# Altium project LampOne.PrjPcb
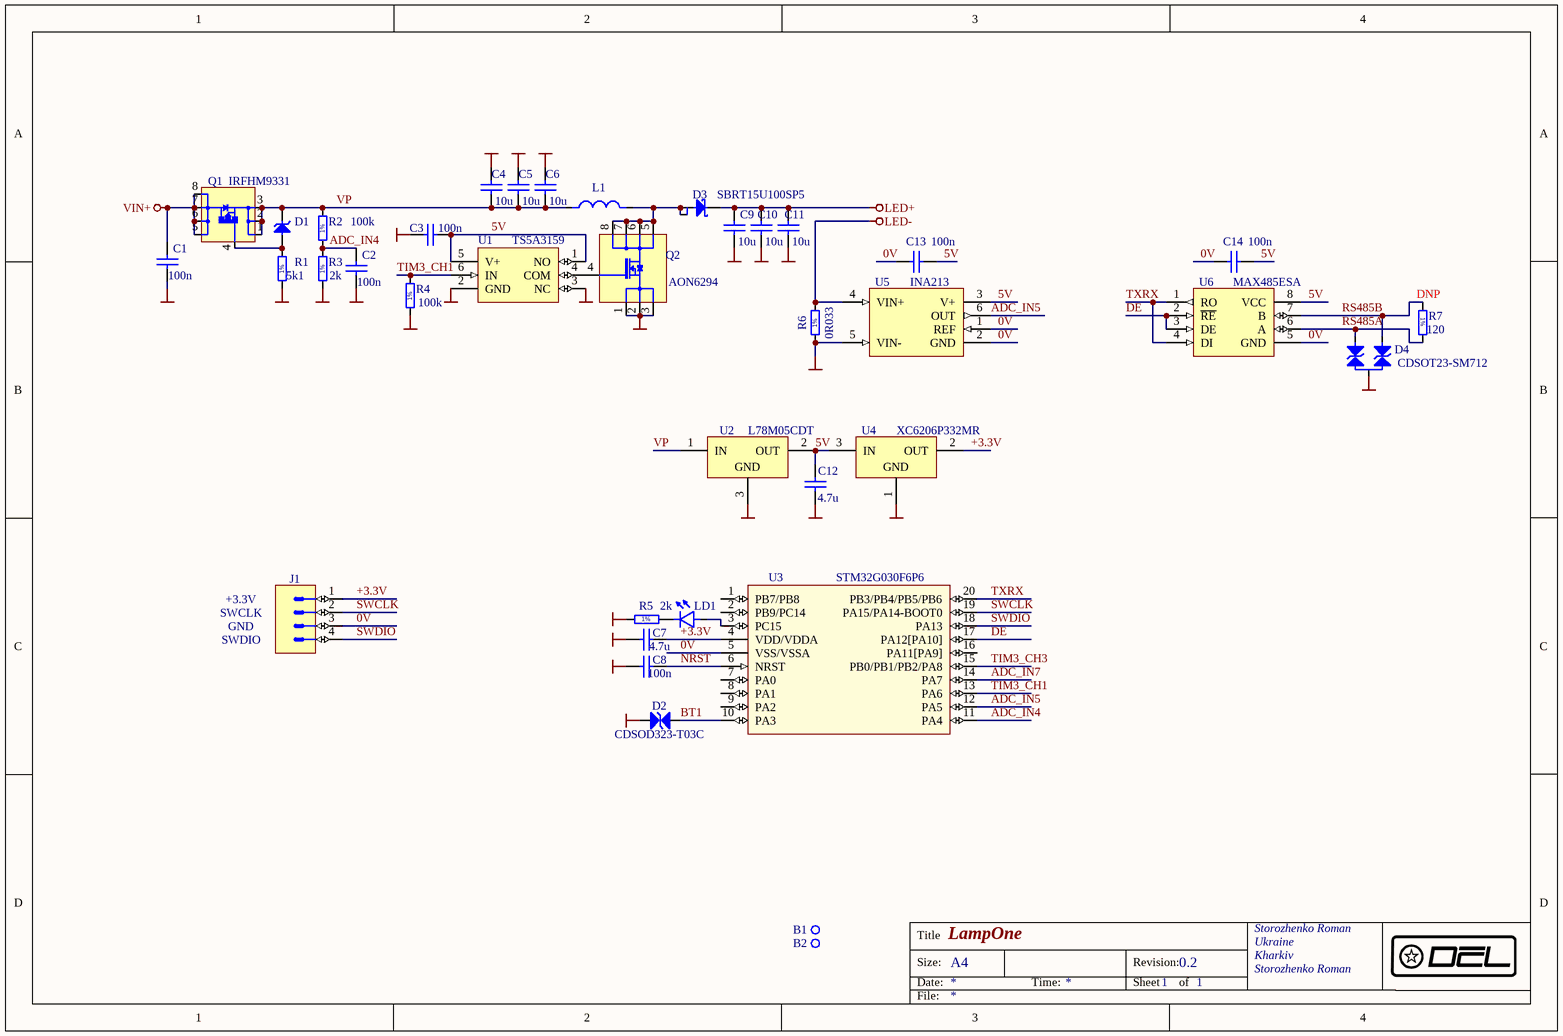
[diagram p0: LampOne.SchDoc]
1 sheet, 38 parts. Net scope: global (net labels, ports and power ports of the same name join across sheets).
Board file: LampOne.PcbDoc

## Sheet LampOne.SchDoc: LampOne
size A4; ApprovedBy: Storozhenko Roman; CheckedBy: Storozhenko Roman; Author: Storozhenko Roman; CompanyName: D_EL; Organization: Storozhenko Roman; Address1: Ukraine; Address2: Kharkiv; Revision: 0.2; SheetNumber: 1; SheetTotal: 1

### Parts
B1  Non Plated Hole  [MTG600H320V8P]  (value not drawn)
B2  Non Plated Hole  [MTG600H320V8P]  (value not drawn)
C1  100n  [CAPC1608X87N]
C2  100n  [CAPC1608X87N]
C3  100n  [CAPC1608X87N]
C4  10u  [CAPC3225X270N]
C5  10u  [CAPC3225X270N]
C6  10u  [CAPC3225X270N]
C7  4.7u  [CAPC1608X87N]
C8  100n  [CAPC1608X87N]
C9  10u  [CAPC3225X270N]
C10  10u  [CAPC3225X270N]
C11  10u  [CAPC3225X270N]
C12  4.7u  [CAPC1608X87N]
C13  100n  [CAPC1608X87N]
C14  100n  [CAPC1608X87N]
D1  BZV55-B10  [DIOMELF3515N]  (value not drawn)
D2  CDSOD323-T03C  [SOD2512X110N]
D3  SBRT15U100SP5  [SBRT15U100SP5]
D4  CDSOT23-SM712  [SOT95P240X130-3N]
J1  Header 4  [3M_2304-6111-TG]  (value not drawn)
L1  10uH  [IND_BOURNS_PM127SH]  (value not drawn)
LD1  Red  [LEDC1608X80N_RED]  (value not drawn)
Q1  IRFHM9331  [PQFN50P300X300X100_HS-9N]
Q2  AON6294  [DFN-5X6-8L]
R1  5k1  [RESC1608X55N]
R2  100k  [RESC1608X55N]
R3  2k  [RESC1608X55N]
R4  100k  [RESC1608X55N]
R5  2k  [RESC1608X55N]
R6  0R033  [RESC3216X80N]
R7  120  Mounted: DNP  [RESC1005X40N]
U1  TS5A3159  [SOT65P210X110-6N]
U2  L78M05CDT  [TO228P1010X239-3N-R521X544]
U3  STM32G030F6P6  [SOP65P640X110-20N]
U4  XC6206P332MR  [SOT95P280X115-3N]
U5  INA213  [SOT65P210X110-6N]
U6  MAX485ESA  [SOIC127P600X175-8N]

### Nets
0V: C1.1 C2.1 C3.2 C4.1 C5.1 C6.1 C7.1 C8.1 C9.1 C10.1 C11.1 C12.1 C13.2 C14.2 D2.2(A) D4.3 J1.3 Q2.1(S) Q2.2(S) Q2.3(S) R1.1 R3.1 R4.1 R5.1 R6.1 U1.2(GND) U1.3(NC) U2.3(GND) U3.5(VSS/VSSA) U4.1(GND) U5.1(REF) U5.2(GND) U5.5(VIN-) U6.5(GND)
LED+: C9.2 C10.2 C11.2 D3.3(C)
LED-: R6.2 U5.4(VIN+)
VIN+: C1.2 Q1.5(D) Q1.6(D) Q1.7(D) Q1.8(D)
5V: C3.1 C12.2 C13.1 C14.1 U1.1(NO) U1.5(V+) U2.2(OUT) U4.3(IN) U5.3(V+) U6.8(VCC)
+3.3V: C7.2 J1.1 U3.4(VDD/VDDA) U4.2(OUT)
ADC_IN4: C2.2 R2.1 R3.2 U3.11(PA4)
ADC_IN5: U3.12(PA5) U5.6(OUT)
ADC_IN7: U3.14(PA7)
BT1: D2.1(C) U3.10(PA3)
DE: U3.17(PA12[PA10]) U6.2(~{RE}) U6.3(DE)
NRST: C8.2 U3.6(NRST)
RS485A: D4.2 R7.2 U6.6(A)
RS485B: D4.1 R7.1 U6.7(B)
SWCLK: J1.2 U3.19(PA15/PA14-BOOT0)
SWDIO: J1.4 U3.18(PA13)
TIM3_CH1: R4.2 U1.6(IN) U3.13(PA6)
TIM3_CH3: U3.15(PB0/PB1/PB2/PA8)
TXRX: U3.20(PB3/PB4/PB5/PB6) U6.1(RO) U6.4(DI)
VP: C4.2 C5.2 C6.2 D1.1(C) L1.1 Q1.1(S) Q1.2(S) Q1.3(S) R2.2 U2.1(IN)
NetD1_2: D1.2(A) Q1.4(S) R1.2
NetD3_1: D3.1(A) D3.2(A) L1.2 Q2.5(D) Q2.6(D) Q2.7(D) Q2.8(D)
NetLD1_1: LD1.1(C) R5.2
NetLD1_2: LD1.2(A) U3.3(PC15)
NetQ2_4: Q2.4(G) U1.4(COM)

Not connected (* = marked no-connect by the designer): B1 1; B2 1; U3 1(PB7/PB8) 2(PB9/PC14) 7(PA0) 8(PA1) 9(PA2) 16(PA11[PA9])

### Notes on the sheet
- +3.3V
- SWCLK
- GND
- SWDIO
- Title
- Size:
- Date:
- A4
- Time:
- Revision:
- Sheet
- of
- File:
- (in symbol R0402_120R_1%_0.0625W_100PPM) 1%
- (in symbol R0603_2K_1%_0.1W_100PPM) 1%
- (in symbol R0603_5K1_1%_0.1W_100PPM) 1%
- (in symbol R0603_100K_1%_0.1W_100PPM) 1%
- (in symbol R1206_0R033_1%_0.25W_100PPM) 1%

### Library data of the parts
B1 B2 = NON-PLATED_HOLE3.2_PAD6.0_8p: Single Terminal Socket; Part Description: Through Hole: Hole Dia.=3.2mm Pad Dia.=6mm + 6 Via Dia.=0.3mm; Mounted: No; Part Number: NON-PLATED_HOLE3.2_PAD6.0_8p; Component Kind: Standard (No BOM); Component Type: Standard (No BOM); Pin Count: 1; Family: Non Plated Hole; Socket: No; SMD: No; Status: None; ComponentHeight: 0mm; Author: DEL; CreateDate: 11/21/2022; LatestRevisionDate: 11/21/2022; PackageDescription: Non Plated Through Hole: Hole Dia.=3.2mm
C1-C3 C8 C13 C14 = CC0603_100NF_50V_10%_X7R: Non-polarised capacitor; Part Description: SMD Multilayer Chip Ceramic Capacitor; Manufacturer: GENERIC; Voltage: 50V; TC: X7R; Tolerance: ±10%; Part Number: CC0603_100NF_50V_10%_X7R; Component Kind: Standard; Component Type: Standard; Pin Count: 2; Value: 100n; Status: Preferred; Manufacturer Part Number: CC0603_100NF_50V_10%_X7R; Case: 0603; Mounted: Yes; Socket: No; SMD: Yes; Manufacturer1 ComponentHeight: 0.87mm; Author: Elman; CreateDate: 7/14/2014; LatestRevisionDate: 7/14/2014
C4-C6 C9-C11 = CC1210_10UF_25V_10%_X7R: Non-polarised capacitor; Part Number: CC1210_10UF_50V_10%_X7R; Part Description: SMD Multilayer Chip Ceramic Capacitor; Manufacturer: GENERIC; Manufacturer1 Part Number: C1210C106K3RAC; Voltage: 50V; TC: X7R; Tolerance: ±10%; Component Kind: Standard; Component Type: Standard; Pin Count: 2; Value: 10u; Status: None; Manufacturer Part Number: CC1210_10UF_50V_10%_X7R; Case: 1210; Mounted: Yes; Socket: No; SMD: Yes; Manufacturer1 Example: KEMET; Manufacturer1 ComponentHeight: 2.7mm; HelpURL: \\cern.ch\dfs\Applications\Altium\Datasheets\CC1210_X7R_KEMET.pdf; Author: CERN DEM JLC; CreateDate: 5/5/2009; LatestRevisionDate: 4/1/2010
C7 C12 = CC0603_4.7UF_10V_10%_X5R: Non-polarised capacitor; Part Description: SMD Multilayer Chip Ceramic Capacitor; Manufacturer: GENERIC; Manufacturer1 Part Number: C1608X5R1A475K080AC; Voltage: 10V; TC: X5R; Tolerance: ±10%; Part Number: CC0603_4.7UF_10V_10%_X5R; Component Kind: Standard; Component Type: Standard; Pin Count: 2; Value: 4.7u; Status: Preferred; Manufacturer Part Number: CC0603_4.7uF_10V_10%_X5R; Case: 0603; Mounted: Yes; Socket: No; SMD: Yes; Manufacturer1 Example: TDK; Manufacturer1 ComponentHeight: 0.95mm; Author: ELMAN; CreateDate: 11/13/2016; LatestRevisionDate: 11/13/2016
D1 = BZV55-B10: Zener Diode; Part Description: Voltage Regulator Diode; Manufacturer: PHILIPS NXP; Voltage: 10V; Power: 500mW; Part Number: BZV55-B10; Component Kind: Standard; Component Type: Standard; Device: BZV55-B10; PackageDescription: SOD80C, MELF Diode, 2-Leads, Body 3.5x1.5mm, IPC Medium Density; Manufacturer Part Number: BZV55-B10; Pin Count: 2; Case: SOD-80C; Mounted: Yes; Socket: No; SMD: Yes; ComponentHeight: 1.6mm; HelpURL: \\cern.ch\dfs\Applications\Altium\Datasheets\BZV55.pdf; Author: CERN DEM JLC; CreateDate: 5/6/2008; LatestRevisionDate: 5/6/2008
D2 = CDSOD323-T03C: Transient Voltage Suppressor Diode (Bi-Directional); Part Description: TVS Diode; Manufacturer: BOURNS; Voltage: 4V; Power: 20A; Part Number: CDSOD323-T03C; Component Kind: Standard; Component Type: Standard; Device: CDSOD323-T03C; PackageDescription: SOD-323, 1.70mm W X 1.25mm L X 1.10mm H; Manufacturer Part Number: CDSOD323-T03C; Pin Count: 3; Case: SOD323; Mounted: Yes; Socket: No; SMD: Yes; ComponentHeight: 1.1mm; Author: DEL; CreateDate: 11/21/2022; LatestRevisionDate: 11/21/2022
D3 = SBRT15U100SP5: Diode  Schottky Anode pin 1 and 2 cathode pin 3; Part Description: Schottky Rectifier; Manufacturer: DIODES; Voltage: 100V; Power: 15A; Part Number: SBRT15U100SP5; Component Kind: Standard; Component Type: Standard; Device: SBRT15U100SP5; PackageDescription: DFN, 3-Leads, Body 4.05x6.6mm; Manufacturer Part Number: SBRT15U100SP5; Pin Count: 3; Case: DFN; Mounted: Yes; Socket: No; SMD: Yes; ComponentHeight: 1.15mm; Author: DEL; CreateDate: 6/24/2022; LatestRevisionDate: 6/24/2022
D4 = CDSOT23-SM712: Transient Voltage Suppressor Diode (Bi-Directional); Part Description: TVS Diode; Manufacturer: BOURNS; Voltage: 7.5V; Power: 17A; Part Number: CDSOT23-SM712; Component Kind: Standard; Component Type: Standard; Device: CDSOT23-SM712; PackageDescription: SOT23 3-Leads, Pitch 0.95mm - Body 1.3x2.9mm, IPC Medium Density; Manufacturer Part Number: CDSOT23-SM712; Pin Count: 3; Case: SOT23-3; Mounted: Yes; Socket: No; SMD: Yes; ComponentHeight: 1.3mm; Author: DEL; CreateDate: 1/27/2022; LatestRevisionDate: 1/27/2022
J1 = 3M_2304-6111-TG: Connector 4 Male; Part Description: 4 Contacts - Vertival Contacts Straight Strip Header Pitch 2.54; Manufacturer: 3M; Part Number: 3M_2304-6111-TG; Component Kind: Standard; Component Type: Standard; Pin Count: 4; Family: Header 4; Mounted: Yes; Socket: No; SMD: No; Status: None; Manufacturer Part Number: 3M_2304-6111-TG; ComponentHeight: 8.4mm; Author: DEL; CreateDate: 2018-09-13; LatestRevisionDate: 2018-09-13
L1 = IND_4.7UH_20%_SUMIDA_CDRH124: Inductor; Part Number: IND_10UH_20%_SUMIDA_CDRH125; Part Description: Shielded SMD Power Inductors CDRH125 Series; Manufacturer: SUMIDA; Manufacturer Part Number: CDRH125NP-10R; Power: 4A; Resistance: 0.018R; Tolerance: ±20%; Component Kind: Standard; Component Type: Standard; Pin Count: 2; Value: 10uH; Status: None; Mounted: Yes; Socket: No; SMD: Yes; ComponentHeight: 4.5mm; HelpURL: \\cern.ch\dfs\Applications\Altium\Datasheets\IND_BOURNS_PM127SH.pdf; Author: CERN DEM JLC; CreateDate: 11/18/2009; LatestRevisionDate: 11/18/2009
LD1 = LED_ROHM_SML-311UTT86K: LED 1C 2A; Part Description: Low current chip LED SML-311 Serie; Manufacturer: ROHM; Part Number: LED_ROHM_SML-311UTT86K; Component Kind: Standard; Component Type: Standard; Color: Red; PackageDescription: Chip Red LED, 2-Leads, Body 1.6x0.8mm, IPC Medium Density; Manufacturer Part Number: SML-311UTT86K; Pin Count: 2; Mounted: Yes; Socket: No; SMD: Yes; ComponentHeight: 0.8mm; HelpURL: \\cern.ch\dfs\Applications\Altium\Datasheets\LED_ROHM_SML-311UTT86K.pdf; Author: CERN DEM JLC; CreateDate: 3/16/2010; LatestRevisionDate: 3/17/2010
Q1 = IRFHM9331TRPbF: P-CHANNEL MOSFET WITH DIODE; Part Description: -30V 11A 0.014 Ohm P-Channel  MOSFET; Manufacturer: INFINEON; Part Number: IRFHM9331TRPbF; Component Kind: Standard; Component Type: Standard; Device: IRFHM9331; PackageDescription: PQFN, 8-Leads, Body 3,00x3,00mm, Pitch 0,50mm, Thermal Pad 4,00x2,20mm, IPC Medium Density; Manufacturer Part Number: IRFHM9331TRPbF; Pin Count: 8; Case: PQFN; Mounted: Yes; Socket: No; SMD: Yes; ComponentHeight: 1mm; Author: DEL; CreateDate: 29.01.2018; LatestRevisionDate: 29.01.2018
Q2 = AON6294: Part Description: 100V N-Channel AlphaMOS; Manufacturer: LPHA & OMEGA SEMICONDUCTOR; Part Number: AON6294; Component Kind: Standard; Component Type: Standard; Device: AON6294; PackageDescription: DFN 5x6; Manufacturer Part Number: AON6294; Pin Count: 8; Case: DFN-5X6; Mounted: Yes; Socket: No; SMD: Yes; ComponentHeight: 1mm; Author: DEL; CreateDate: 6/24/2022; LatestRevisionDate: 6/24/2022
R1 = R0603_5K1_1%_0.1W_100PPM: Resistor - 1%; Part Description: General Purpose Thick Film Chip Resistor; Manufacturer: GENERIC; Manufacturer1 Part Number: NRC06F5101TRF; Power: 0.1W; TC: ±100ppm/°C; Part Number: R0603_5K1_1%_0.1W_100PPM; Component Kind: Standard; Component Type: Standard; Pin Count: 2; Value: 5k1; Status: Preferred; Tolerance: ±1%; Manufacturer Part Number: R0603_5K1_1%_0.1W_100PPM; Case: 0603; Mounted: Yes; Socket: No; SMD: Yes; Manufacturer1 Example: NIC COMPONENT; Manufacturer1 ComponentHeight: 0.55mm; HelpURL: \\cern.ch\dfs\Applications\Altium\Datasheets\R0603_NIC_NRC.pdf; Author: CERN DEM JLC; CreateDate: 12/3/2007; LatestRevisionDate: 3/13/2008
R2 R4 = R0603_100K_1%_0.1W_100PPM: Resistor - 1%; Part Description: General Purpose Thick Film Chip Resistor; Manufacturer: GENERIC; Manufacturer1 Part Number: NRC06F1003TRF; Power: 0.1W; TC: ±100ppm/°C; Part Number: R0603_100K_1%_0.1W_100PPM; Component Kind: Standard; Component Type: Standard; Pin Count: 2; Value: 100k; Status: Preferred; Tolerance: ±1%; Manufacturer Part Number: R0603_100K_1%_0.1W_100PPM; Case: 0603; Mounted: Yes; Socket: No; SMD: Yes; Manufacturer1 Example: NIC COMPONENT; Manufacturer1 ComponentHeight: 0.55mm; HelpURL: \\cern.ch\dfs\Applications\Altium\Datasheets\R0603_NIC_NRC.pdf; Author: CERN DEM JLC; CreateDate: 12/3/2007; LatestRevisionDate: 3/13/2008
R3 R5 = R0603_2K_1%_0.1W_100PPM: Resistor - 1%; Part Description: General Purpose Thick Film Chip Resistor; Manufacturer: GENERIC; Manufacturer1 Part Number: NRC06F2001TRF; Power: 0.1W; TC: ±100ppm/°C; Part Number: R0603_2K_1%_0.1W_100PPM; Component Kind: Standard; Component Type: Standard; Pin Count: 2; Value: 2k; Status: Preferred; Tolerance: ±1%; Manufacturer Part Number: R0603_2K_1%_0.1W_100PPM; Case: 0603; Mounted: Yes; Socket: No; SMD: Yes; Manufacturer1 Example: NIC COMPONENT; Manufacturer1 ComponentHeight: 0.55mm; HelpURL: \\cern.ch\dfs\Applications\Altium\Datasheets\R0603_NIC_NRC.pdf; Author: CERN DEM JLC; CreateDate: 12/3/2007; LatestRevisionDate: 3/13/2008
R6 = R1206_0R033_1%_0.25W_100PPM: Resistor - 1%; Part Description: Low Value Flat Chip Resistor; Manufacturer: YAGEO; Manufacturer Part Number: RC1206FR-0733RL; Power: 0.25W; TC: ±100ppm/°C; Part Number: R1206_0R033_1%_0.25W_100PPM; Component Kind: Standard; Component Type: Standard; Pin Count: 2; Value: 0R033; Tolerance: ±1%; Case: 1206; Mounted: Yes; Socket: No; SMD: Yes; ComponentHeight: 0.65mm; Author: DEL; CreateDate: 10/28/2023; LatestRevisionDate: 10/28/2023
R7 = R0402_120R_1%_0.0625W_100PPM: Resistor - 1%; Part Description: General Purpose Thick Film Chip Resistor; Manufacturer: GENERIC; Manufacturer1 Part Number: 232270671201; TC: ±100ppm/°C; Part Number: R0402_120R_1%_0.0625W_100PPM; Component Kind: Standard; Component Type: Standard; Pin Count: 2; Value: 120; Status: Not recommended; Power: 0.0625W; Tolerance: ±1%; Manufacturer Part Number: R0402_120R_1%_0.0625W_100PPM; Case: 0402; Socket: No; SMD: Yes; Manufacturer1 Example: PHYCOMP; Manufacturer1 ComponentHeight: 0.4mm; HelpURL: \\cern.ch\dfs\Applications\Altium\Datasheets\R0402_Phycomp_RC0402.pdf; Author: CERN DEM JLC; CreateDate: 12/3/2007; LatestRevisionDate: 3/13/2008
U1 = TS5A3159DCKR: 1-Ω SPDT Analog Switch; Manufacturer: TEXAS INSTRUMENTS; Manufacturer Part Number: ADS1271IBPW; Part Number: TS5A3159DCKR; Component Kind: Standard; Component Type: Standard; Device: TS5A3159; PackageDescription: SC70-6, SOT, 0.65mm Pitch, 6 pin; Part Description: 1-Ω SPDT Analog Switch; Pin Count: 6; Case: SC70-6; Mounted: Yes; Socket: No; SMD: Yes; ComponentHeight: 1.1mm; Author: DEL; CreateDate: 6/20/2022; LatestRevisionDate: 6/20/2022
U2 = L78M05CDT-TR: 3-Terminal Regulator 1=IN 2=OUT 3=GND; Part Description: 3-Terminal 5V 0.5A Positive Voltage Regulator; Manufacturer: ST MICROELECTRONICS; Manufacturer Part Number: LM7805CT; Part Number: L78M05CDT-TR; Component Kind: Standard; Component Type: Standard; Device: L78M05CDT; PackageDescription: TO-252 DPAK TO, 2.28mm pitch; 2 pin, 10.105mm L X 6.095mm W X 2.39mm H body, IPC Medium Density; Pin Count: 3; Case: DPAK; Mounted: Yes; Socket: No; SMD: No; ComponentHeight: 2.39mm; Author: DEL; CreateDate: 12/13/2017; LatestRevisionDate: 12/13/2017
U3 = STM32G030F6P6: Arm® Cortex®-M0+ 32-bit MCU; Manufacturer: ST Microelectronics; Manufacturer Part Number: STM32F030F4P6; Part Number: STM32G030F6P6; Component Kind: Standard; Component Type: Standard; Device: STM32G030F6P6; PackageDescription: SOP, 20-Leads, Body 6.6x4.5mm (max), Pitch 0.65mm, IPC Medium Density; Part Description: Arm® Cortex®-M0+ 32-bit MCU; Pin Count: 20; Case: TSSOP20; Mounted: Yes; Socket: No; SMD: Yes; ComponentHeight: 1.2mm; Author: DEL; CreateDate: 1/26/2022; LatestRevisionDate: 7/21/2025
U4 = XC6206P332MR: 3-Terminal Regulator 1=GND 2=OUT 3=IN; Part Description: 3-Terminal 3.3V 200mA Positive Voltage Regulator; Manufacturer: TOREX; Part Number: XC6206P332MR; Component Kind: Standard; Component Type: Standard; Device: XC6206P332MR; PackageDescription: SOT23 3-Leads, Pitch 0.95mm - Body 1.3x2.9mm, IPC Medium Density; Manufacturer Part Number: SOT95P280X115-3N; Pin Count: 3; Case: SOT23; Mounted: Yes; Socket: No; SMD: Yes; ComponentHeight: 1.1mm; Author: DEL; CreateDate: 1/27/2022; LatestRevisionDate: 1/27/2022
U5 = INA213xID: INA21x Voltage Output, Low- or High-Side Measurement, Bidirectional, Zero-Drift Series, Current-Shunt Monitors. Wide Common-Mode Range: –0.3 V to 26 V.; Part Description: Current-Shunt Monitors,  –0.3 V to 26 V; Manufacturer: TEXAS INSTRUMENTS; Manufacturer Part Number: INA213AIDCKT; Part Number: INA213xID; Component Kind: Standard; Component Type: Standard; Device: INA213; PackageDescription: SOT363, SC70-6, SOT, 0.65mm Pitch, 6 pin, 1.25mm W X 2.00mm L X 1.10mm H, IPC Medium Density; Pin Count: 6; Case: SC70-6; Mounted: Yes; Socket: No; SMD: Yes; ComponentHeight: 1.1mm; Author: DEL; CreateDate: 10/9/2017; LatestRevisionDate: 10/9/2017
U6 = MAX485ESA: Low-Power, Slew-Rate-Limited / RS-485/RS-422 Transceivers; Manufacturer: MAXIM; Part Number: MAX485ESA; Component Kind: Standard; Component Type: Standard; Device: MAX485ESA; PackageDescription: SOIC 8, Pitch 1.27mm - Body 4x5mm, IPC Medium Density; Part Description: Low-Power, Slew-Rate-Limited RS-485/RS-422 Transceivers; Manufacturer Part Number: MAX485ESA; Pin Count: 8; Case: SOIC8; Mounted: Yes; Socket: No; SMD: Yes; ComponentHeight: 1.75mm; Author: DEL; CreateDate: 1/20/2020; LatestRevisionDate: 1/20/2020